# EAGLE design sqrwear-ledmatrix (EAGLE 6.5.0)
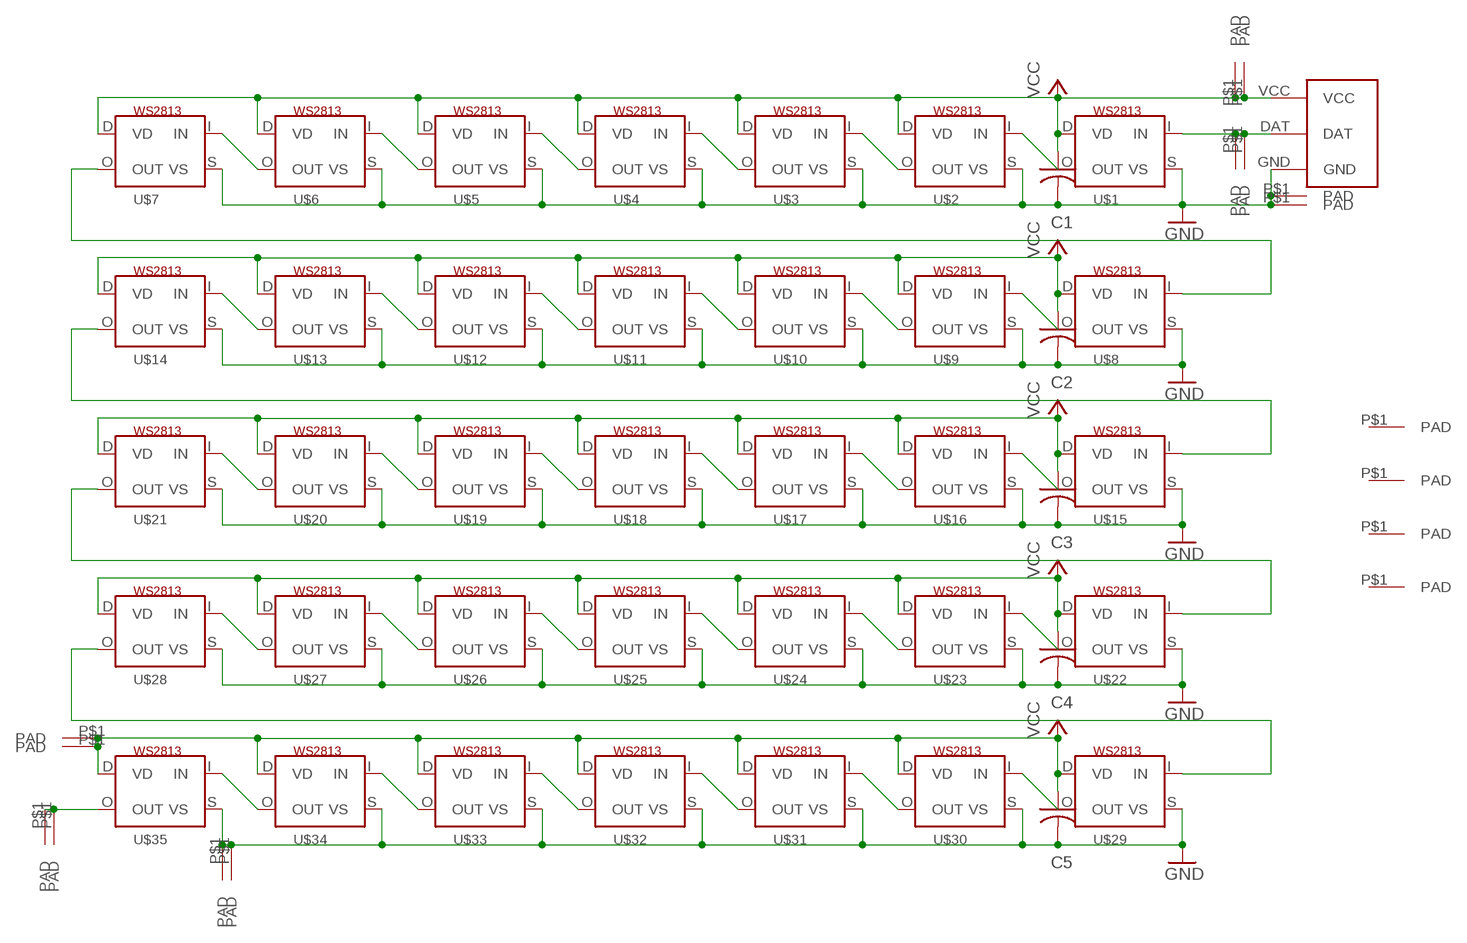
[diagram p0: schematic, sheet 1]

## Parts
C1  C-USC0805K  [C0805K]
C2  C-USC0805K  [C0805K]
C3  C-USC0805K  [C0805K]
C4  C-USC0805K  [C0805K]
C5  C-USC0805K  [C0805K]
U$1  WS2813  [RGBLED5050_4]
U$2  WS2813  [RGBLED5050_4]
U$3  WS2813  [RGBLED5050_4]
U$4  WS2813  [RGBLED5050_4]
U$5  WS2813  [RGBLED5050_4]
U$6  WS2813  [RGBLED5050_4]
U$7  WS2813  [RGBLED5050_4]
U$8  WS2813  [RGBLED5050_4]
U$9  WS2813  [RGBLED5050_4]
U$10  WS2813  [RGBLED5050_4]
U$11  WS2813  [RGBLED5050_4]
U$12  WS2813  [RGBLED5050_4]
U$13  WS2813  [RGBLED5050_4]
U$14  WS2813  [RGBLED5050_4]
U$15  WS2813  [RGBLED5050_4]
U$16  WS2813  [RGBLED5050_4]
U$17  WS2813  [RGBLED5050_4]
U$18  WS2813  [RGBLED5050_4]
U$19  WS2813  [RGBLED5050_4]
U$20  WS2813  [RGBLED5050_4]
U$21  WS2813  [RGBLED5050_4]
U$22  WS2813  [RGBLED5050_4]
U$23  WS2813  [RGBLED5050_4]
U$24  WS2813  [RGBLED5050_4]
U$25  WS2813  [RGBLED5050_4]
U$26  WS2813  [RGBLED5050_4]
U$27  WS2813  [RGBLED5050_4]
U$28  WS2813  [RGBLED5050_4]
U$29  WS2813  [RGBLED5050_4]
U$30  WS2813  [RGBLED5050_4]
U$31  WS2813  [RGBLED5050_4]
U$32  WS2813  [RGBLED5050_4]
U$33  WS2813  [RGBLED5050_4]
U$34  WS2813  [RGBLED5050_4]
U$35  WS2813  [RGBLED5050_4]
U$36  SQWMINI-MATRIX  [SQWMINI-MATRIX]
U$37  TESTPAD  [TESTPAD]
U$38  TESTPAD  [TESTPAD]
U$39  TESTPAD  [TESTPAD]
U$40  TESTPAD  [TESTPAD]
U$41  TESTPAD  [TESTPAD]
U$42  TESTPAD  [TESTPAD]
U$43  TESTPAD  [TESTPAD]
U$44  TESTPAD  [TESTPAD]
U$45  TESTPAD  [TESTPAD]
U$46  TESTPAD  [TESTPAD]
U$47  TESTPAD  [TESTPAD]
U$48  TESTPAD  [TESTPAD]
U$49  TESTPAD  [TESTPAD]
U$50  TESTPAD  [TESTPAD]
U$51  TESTPAD  [TESTPAD]
U$52  TESTPAD  [TESTPAD]

## Nets
DATIN: U$1.I(IN) U$36.DAT U$41.P$1(PAD) U$42.P$1(PAD)
DATOUT: U$35.O(OUT) U$47.P$1(PAD) U$48.P$1(PAD)
GND: C1.2 C2.2 C3.2 C4.2 C5.2 U$1.S(VS) U$2.S(VS) U$3.S(VS) U$4.S(VS) U$5.S(VS) U$6.S(VS) U$7.S(VS) U$8.S(VS) U$9.S(VS) U$10.S(VS) U$11.S(VS) U$12.S(VS) U$13.S(VS) U$14.S(VS) U$15.S(VS) U$16.S(VS) U$17.S(VS) U$18.S(VS) U$19.S(VS) U$20.S(VS) U$21.S(VS) U$22.S(VS) U$23.S(VS) U$24.S(VS) U$25.S(VS) U$26.S(VS) U$27.S(VS) U$28.S(VS) U$29.S(VS) U$30.S(VS) U$31.S(VS) U$32.S(VS) U$33.S(VS) U$34.S(VS) U$35.S(VS) U$36.GND U$39.P$1(PAD) U$40.P$1(PAD) U$45.P$1(PAD) U$46.P$1(PAD)
N$1: U$2.O(OUT) U$3.I(IN)
N$2: U$1.O(OUT) U$2.I(IN)
N$3: U$4.O(OUT) U$5.I(IN)
N$4: U$22.O(OUT) U$23.I(IN)
N$5: U$6.O(OUT) U$7.I(IN)
N$6: U$3.O(OUT) U$4.I(IN)
N$7: U$8.O(OUT) U$9.I(IN)
N$8: U$7.O(OUT) U$8.I(IN)
N$9: U$5.O(OUT) U$6.I(IN)
N$10: U$9.O(OUT) U$10.I(IN)
N$11: U$10.O(OUT) U$11.I(IN)
N$12: U$11.O(OUT) U$12.I(IN)
N$13: U$13.O(OUT) U$14.I(IN)
N$14: U$12.O(OUT) U$13.I(IN)
N$15: U$15.O(OUT) U$16.I(IN)
N$16: U$14.O(OUT) U$15.I(IN)
N$17: U$16.O(OUT) U$17.I(IN)
N$18: U$17.O(OUT) U$18.I(IN)
N$19: U$18.O(OUT) U$19.I(IN)
N$20: U$20.O(OUT) U$21.I(IN)
N$21: U$19.O(OUT) U$20.I(IN)
N$22: U$23.O(OUT) U$24.I(IN)
N$24: U$24.O(OUT) U$25.I(IN)
N$25: U$25.O(OUT) U$26.I(IN)
N$26: U$27.O(OUT) U$28.I(IN)
N$27: U$26.O(OUT) U$27.I(IN)
N$28: U$21.O(OUT) U$22.I(IN)
N$29: U$29.O(OUT) U$30.I(IN)
N$30: U$30.O(OUT) U$31.I(IN)
N$31: U$31.O(OUT) U$32.I(IN)
N$32: U$32.O(OUT) U$33.I(IN)
N$33: U$34.O(OUT) U$35.I(IN)
N$34: U$33.O(OUT) U$34.I(IN)
N$35: U$28.O(OUT) U$29.I(IN)
VCC: C1.1 C2.1 C3.1 C4.1 C5.1 U$1.D(VD) U$2.D(VD) U$3.D(VD) U$4.D(VD) U$5.D(VD) U$6.D(VD) U$7.D(VD) U$8.D(VD) U$9.D(VD) U$10.D(VD) U$11.D(VD) U$12.D(VD) U$13.D(VD) U$14.D(VD) U$15.D(VD) U$16.D(VD) U$17.D(VD) U$18.D(VD) U$19.D(VD) U$20.D(VD) U$21.D(VD) U$22.D(VD) U$23.D(VD) U$24.D(VD) U$25.D(VD) U$26.D(VD) U$27.D(VD) U$28.D(VD) U$29.D(VD) U$30.D(VD) U$31.D(VD) U$32.D(VD) U$33.D(VD) U$34.D(VD) U$35.D(VD) U$36.VCC U$37.P$1(PAD) U$38.P$1(PAD) U$43.P$1(PAD) U$44.P$1(PAD)
Unconnected: U$49.P$1(PAD) U$50.P$1(PAD) U$51.P$1(PAD) U$52.P$1(PAD)

## Library data of the parts
C1-C5 = adafruit2013:C-US: CAPACITOR, American symbol
U$1-U$35 = adafruit:WS2813
U$36 = LilyPad-Wearables:SQWMINI-MATRIX
U$37-U$52 = LilyPad-Wearables:TESTPAD

## Net classes
0 default: width 0.203 mm, clearance 0.203 mm

## Board
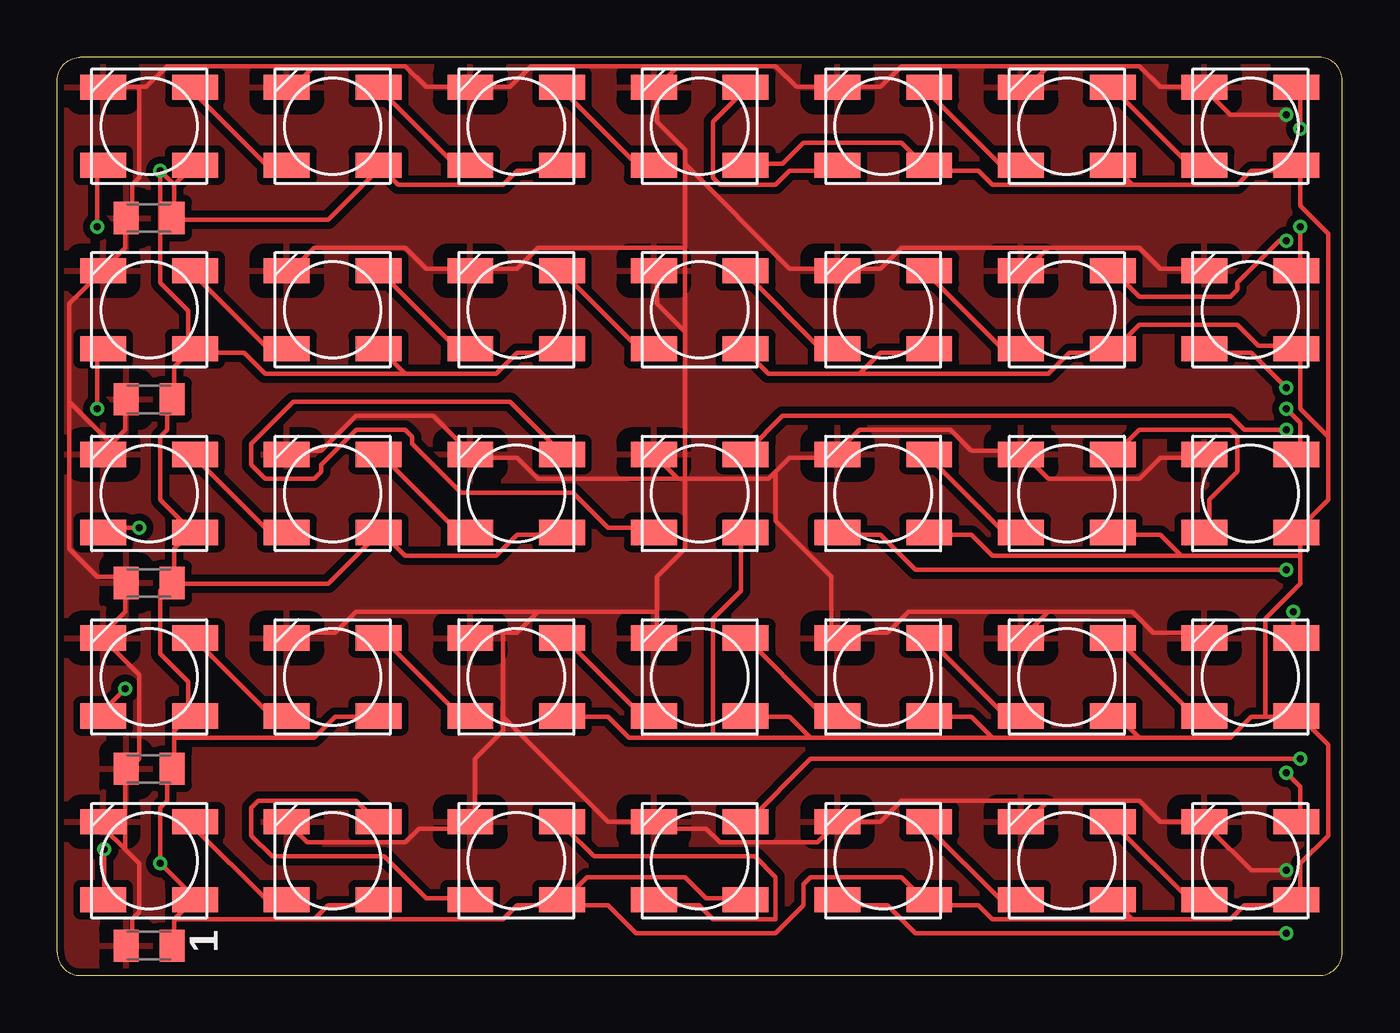
[diagram p1: board, top side]
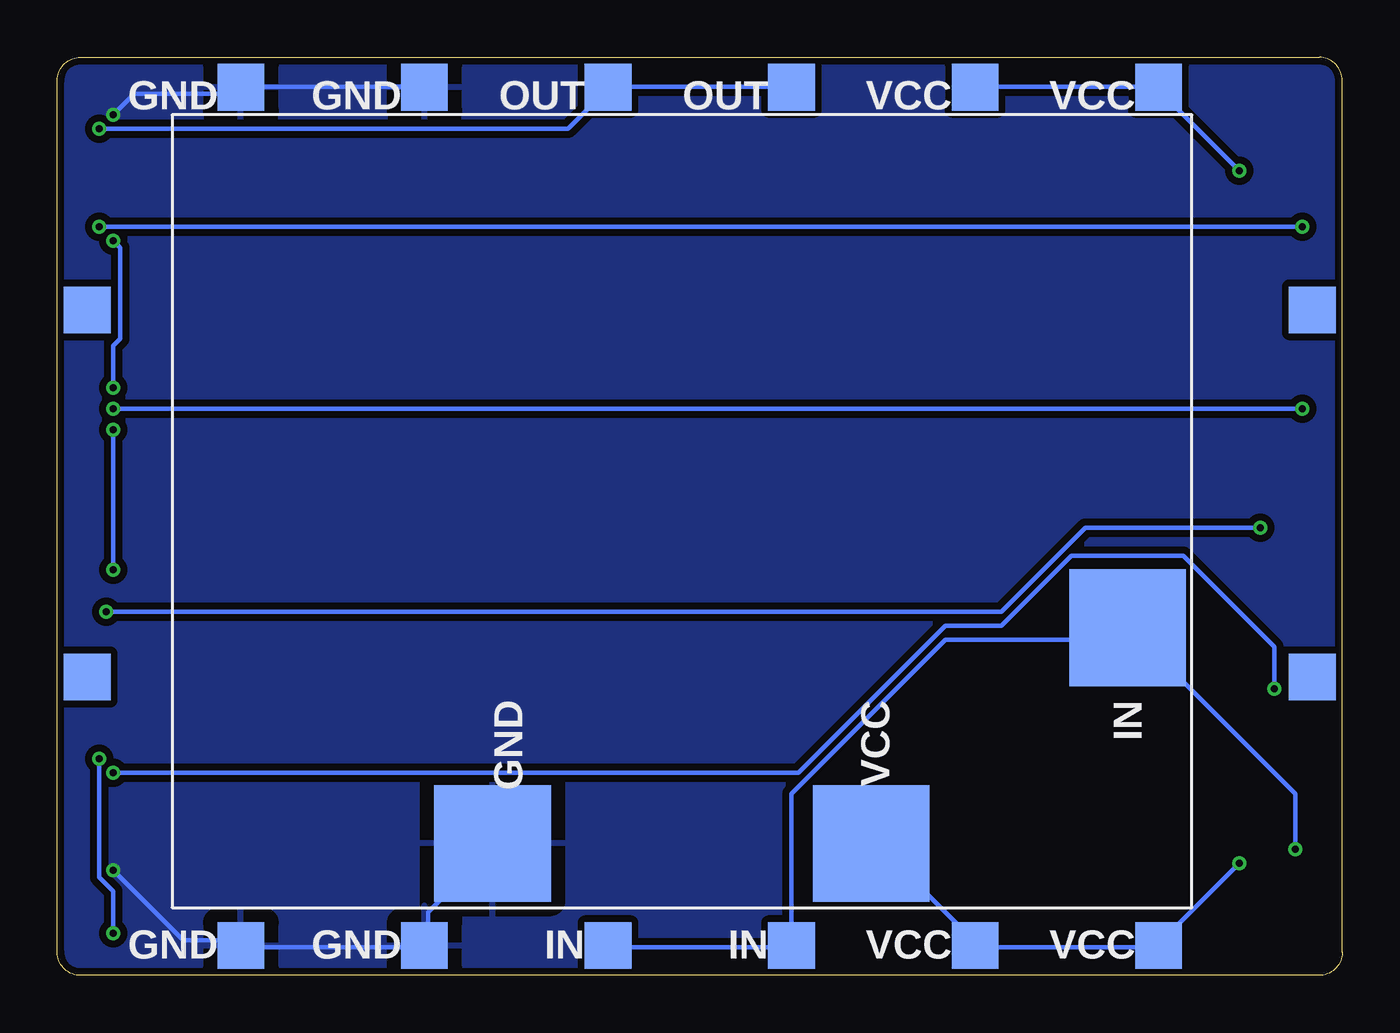
[diagram p2: board, bottom side, seen from below]

Size 56 x 40 mm. Coordinates in mm from the lower left corner, seen from the top.
Outline: 1,0 55,0 arc90 56,1 56,39 arc90 55,40 1,40 arc90 0,39 0,1 arc90 1,0
Copper layers (1*16): Top 0.035mm / dielectric 1.5mm / Bottom 0.035mm
Design rules "Fusion_eagle_rule_v1.1 *": minimum track width 6mil, minimum drill 12mil, track to track 6mil, track to pad 6mil, pad to pad 6mil, via to via 6mil, smd to smd 0mil, copper to edge 10mil, drill to drill 10mil, minimum pad ring 10mil, minimum via ring 6mil, stop-mask expansion 2mil, vias tented up to drill 100mil, thermal gap 25mil
vRestrict: area 0,3 to 40,51

### Footprints (pad centres in the part's own frame; a part is rotated, then mirrored left to right if it is on the bottom)
C0805K = smd 1.1 x 1.4: 1 -1,0; 2 1,0
RGBLED5050_4 = smd 2 x 1.1: D -2,1.7; I 2,1.7; O -2,-1.7; S 2,-1.7
SQWMINI-MATRIX = smd 5.08 x 5.08: DAT 22.352,41.656; GND 31.75,13.97; VCC 31.75,30.48
TESTPAD = smd 2.032 x 2.032: P$1 0,0

### Placement (x,y rotation side)
C1  4,1.3 180 top
C2  4,9 180 top
C3  4,17.1 180 top
C4  4,25.1 180 top
C5  4,33 180 top
U$1  4,5 180 top
U$2  12,5 180 top
U$3  20,5 180 top
U$4  28,5 180 top
U$5  36,5 180 top
U$6  44,5 180 top
U$7  52,5 180 top
U$8  4,13 180 top
U$9  12,13 180 top
U$10  20,13 180 top
U$11  28,13 180 top
U$12  36,13 180 top
U$13  44,13 180 top
U$14  52,13 180 top
U$15  4,21 180 top
U$16  12,21 180 top
U$17  20,21 180 top
U$18  28,21 180 top
U$19  36,21 180 top
U$20  44,21 180 top
U$21  52,21 180 top
U$22  4,29 180 top
U$23  12,29 180 top
U$24  20,29 180 top
U$25  28,29 180 top
U$26  36,29 180 top
U$27  44,29 180 top
U$28  52,29 180 top
U$29  4,37 180 top
U$30  12,37 180 top
U$31  20,37 180 top
U$32  28,37 180 top
U$33  36,37 180 top
U$34  44,37 180 top
U$35  52,37 180 top
U$36  51,37.5 270 bottom
U$37  8,1.3 270 bottom
U$38  16,1.3 270 bottom
U$39  40,1.3 270 bottom
U$40  48,1.3 270 bottom
U$41  24,1.3 270 bottom
U$42  32,1.3 270 bottom
U$43  8,38.7 270 bottom
U$44  16,38.7 270 bottom
U$45  40,38.7 270 bottom
U$46  48,38.7 270 bottom
U$47  24,38.7 270 bottom
U$48  32,38.7 270 bottom
U$49  54.7,13 270 bottom
U$50  54.7,29 270 bottom
U$51  1.3,13 270 bottom
U$52  1.3,29 270 bottom

### Tracks (layer width: path | path; a pad name or v marks a point on that pad's centre or on a via)
DATIN  (via drill 0.3)
  Top 0.203: v2.05,5.49 2.05,3.35 U$1.I
  Bottom 0.203: U$42.P$1 31.92,1.22 24.3,1.22 U$41.P$1 24,1.52 24,7.92 17.29,14.63 8.76,14.63 | v2.05,5.49 2.05,7.92 8.76,14.63 | 8.76,14.63 9.06,14.94 U$36.DAT 8.76,14.63
DATOUT  (via drill 0.3)
  Top 0.203: v54.17,36.88 54.17,38.41 U$35.O
  Bottom 0.203: v54.17,36.88 33.75,36.88 32.23,38.41 U$48.P$1 31.92,38.71 24.3,38.71 U$47.P$1
GND  (via drill 0.3)
  Top 0.203: 2.96,5.49 2.05,6.4 U$1.S | 2.96,5.49 3.57,4.88 3.57,2.74 3.27,2.44 3.27,1.52 C1.2 | 2.96,5.49 2.96,8.84 C2.2 3.27,9.14 3.57,9.45 3.57,13.11 2.05,14.63 U$8.S 2.05,14.94 2.96,15.85 2.96,17.07 C3.2 2.96,17.37 1.75,17.37 0.53,18.59 0.53,24.99 | 2.35,23.16 2.05,22.86 U$15.S 2.35,23.16 | 2.35,23.16 2.96,23.77 2.96,24.99 C4.2 | 11.19,39.62 15.16,39.62 16.07,38.71 17.9,38.71 U$31.S 18.2,38.71 19.73,38.71 20.64,39.62 27.04,39.62 | 11.19,39.62 10.28,38.71 U$30.S | 3.57,38.71 3.88,38.71 4.79,39.62 11.19,39.62 | 3.57,38.71 2.05,38.71 U$29.S | 3.57,38.71 3.57,34.75 3.27,34.44 3.27,33.22 C5.2 2.96,32.92 2.96,31.7 2.05,30.79 U$22.S 1.75,30.48 0.53,29.26 0.53,24.99 | 0.53,24.99 2.35,23.16 | 43.2,7.62 47.16,7.62 48.08,6.71 49.9,6.71 U$7.S 50.21,6.4 52.04,4.57 v53.56,4.57 | 43.2,7.62 42.28,6.71 U$6.S | 43.2,7.62 36.8,7.62 35.88,6.71 34.05,6.71 U$5.S 33.75,6.4 33.14,5.79 28.87,5.79 28.26,6.4 26.13,6.4 U$4.S 25.82,6.71 24,6.71 19.42,11.28 | 43.2,39.62 47.16,39.62 48.08,38.71 49.9,38.71 U$35.S 50.21,38.41 51.12,37.49 v53.56,37.49 | 43.2,39.62 42.28,38.71 U$34.S | 43.2,39.62 36.8,39.62 35.88,38.71 34.05,38.71 U$33.S 33.75,38.71 32.23,38.71 31.31,39.62 27.04,39.62 | 43.2,31.7 47.16,31.7 48.08,30.79 49.9,30.79 U$28.S | 43.2,31.7 42.28,30.79 U$27.S | 43.2,31.7 36.8,31.7 35.88,30.79 34.05,30.79 U$26.S 33.75,30.79 31.92,30.79 27.35,35.36 | 43.2,15.85 46.86,15.85 47.77,14.94 49.9,14.94 U$14.S | 43.2,15.85 42.28,14.94 U$13.S | 43.2,15.85 37.1,15.85 36.19,14.94 34.05,14.94 U$12.S 33.75,14.94 33.75,17.37 31.31,19.81 31.31,21.95 | U$23.S 10.28,30.79 11.19,31.7 15.16,31.7 16.07,30.79 17.9,30.79 U$24.S 18.2,30.79 20.03,30.79 20.95,31.7 27.35,31.7
  Top 0.203: U$21.S 49.9,22.55 48.08,22.55 47.16,21.64 43.2,21.64 42.28,22.55 U$20.S 41.98,22.86 39.85,22.86 38.93,23.77 34.97,23.77 34.05,22.86 U$19.S 33.75,22.55 31.92,22.55 31.31,21.95 | U$2.S 10.28,6.4 10.89,5.79 15.16,5.79 15.77,6.4 17.9,6.4 U$3.S 18.2,6.71 18.2,9.45 19.42,10.67 19.42,11.28 | 31.31,21.95 31.01,21.64 27.35,21.64 | 27.04,21.64 27.35,21.64 | 27.04,21.64 26.13,22.55 U$18.S | 26.13,15.85 26.13,17.37 27.35,18.59 27.35,21.64 | 26.13,15.85 26.13,14.94 U$11.S | 27.35,28.04 26.13,29.26 26.13,30.48 U$25.S | 27.35,21.64 27.35,28.04 | 19.42,14.94 20.03,14.94 20.95,15.85 | 19.42,14.94 18.2,14.94 U$10.S | 26.13,15.85 20.95,15.85 | 27.04,21.64 20.95,21.64 20.03,22.55 18.2,22.55 U$17.S 17.9,22.86 16.38,24.38 13.02,24.38 11.5,22.86 10.28,22.86 U$16.S | 20.95,15.85 13.02,15.85 12.11,14.94 10.28,14.94 U$9.S | 27.35,28.04 27.35,31.7 | 27.35,31.7 27.35,35.36 | 27.35,35.36 27.35,35.97 26.13,37.19 26.13,38.41 U$32.S 26.13,38.71 27.04,39.62 | 19.42,14.94 19.42,11.28
  Bottom 0.203: U$36.GND 37.1,5.49 39.85,2.74 39.85,1.52 U$39.P$1 40.15,1.22 47.77,1.22 U$40.P$1 48.08,1.52 50.51,1.52 v53.56,4.57 | U$45.P$1 40.15,38.71 47.77,38.71 U$46.P$1 48.08,38.41 52.65,38.41 v53.56,37.49
  pour Top (isolate 0.305): -4,0 -4,40 56,40 56,0
  pour Bottom (isolate 0.305): -4,0 -4,40 56,40 56,0
N$1
  Top 0.203: U$3.I 17.9,3.35 16.07,3.35 14.24,5.18 9.37,5.18 8.45,6.1 8.45,7.32 8.76,7.62 13.02,7.62 13.94,6.71 U$2.O
N$2
  Top 0.203: U$2.I 9.97,3.35 9.06,3.35 6.01,6.4 U$1.O
N$3  (via drill 0.3)
  Top 0.203: v53.56,1.83 37.41,1.83 36.19,3.05 34.05,3.05 U$5.I | v54.17,9.45 32.84,9.45 30.09,6.71 U$4.O
  Bottom 0.203: v53.56,1.83 53.56,3.66 54.17,4.27 v54.17,9.45
N$4
  Top 0.203: U$23.I 9.97,27.43 9.06,27.43 6.01,30.48 U$22.O
N$5
  Top 0.203: U$7.I 49.9,3.35 49.29,3.35 46.25,6.4 U$6.O
N$6
  Top 0.203: U$4.I 26.13,3.05 27.96,3.05 28.57,2.44 31.31,2.44 31.31,4.27 30.4,5.18 23.39,5.18 22.17,6.4 U$3.O
N$7
  Top 0.203: U$9.I 9.97,11.58 9.06,11.58 6.01,14.63 U$8.O
N$8  (via drill 0.3)
  Top 0.203: v53.56,8.84 54.17,8.23 54.17,6.71 U$7.O | v2.96,12.5 2.05,11.58 U$8.I
  Bottom 0.203: v53.56,8.84 23.69,8.84 17.29,15.24 14.85,15.24 11.8,18.29 6.93,18.29 2.96,14.33 v2.96,12.5
N$9
  Top 0.203: U$6.I 41.98,3.35 41.06,3.35 38.02,6.4 U$5.O
N$10
  Top 0.203: U$10.I 17.9,11.58 17.29,11.58 14.24,14.63 U$9.O
N$11
  Top 0.203: U$11.I 25.82,11.58 25.21,11.58 22.17,14.63 U$10.O
N$12
  Top 0.203: U$12.I 33.75,11.58 33.14,11.58 30.09,14.63 U$11.O
N$13
  Top 0.203: U$14.I 49.9,11.58 49.29,11.58 46.25,14.63 U$13.O
N$14
  Top 0.203: U$13.I 41.98,11.58 41.06,11.58 38.02,14.63 U$12.O
N$15
  Top 0.203: U$16.I 9.97,19.51 9.06,19.51 6.01,22.55 U$15.O
N$16  (via drill 0.3)
  Top 0.203: v53.87,15.85 53.87,14.94 U$14.O | v3.57,19.51 2.05,19.51 U$15.I
  Bottom 0.203: v53.87,15.85 14.85,15.85 11.19,19.51 v3.57,19.51
N$17
  Top 0.203: U$17.I 17.9,19.51 17.29,19.51 14.24,22.55 U$16.O
N$18
  Top 0.203: U$18.I 25.82,19.51 24,19.51 22.47,21.03 17.59,21.03 15.46,23.16 15.46,23.47 15.16,23.77 13.02,23.77 11.5,22.25 11.5,21.95 11.19,21.64 9.06,21.64 8.45,22.25 8.45,23.16 10.28,24.99 19.73,24.99 21.86,22.86 U$17.O
N$19  (via drill 0.3)
  Top 0.203: v53.56,17.68 37.41,17.68 35.88,19.2 34.05,19.2 U$19.I | v53.56,23.77 51.73,23.77 51.12,24.38 31.62,24.38 30.09,22.86 U$18.O
  Bottom 0.203: v53.56,23.77 v53.56,17.68
N$20
  Top 0.203: U$21.I 50.21,19.51 50.21,20.73 51.43,21.95 51.43,23.47 51.12,23.77 47.16,23.77 46.25,22.86 U$20.O
N$21
  Top 0.203: U$20.I 41.98,19.51 41.06,19.51 38.02,22.55 U$19.O
N$22
  Top 0.203: U$24.I 17.9,27.43 17.29,27.43 14.24,30.48 U$23.O
N$24
  Top 0.203: U$25.I 25.82,27.43 25.21,27.43 22.17,30.48 U$24.O
N$25
  Top 0.203: U$26.I 33.75,27.43 33.14,27.43 30.09,30.48 U$25.O
N$26  (via drill 0.3)
  Top 0.203: v53.56,25.6 52.04,27.13 50.21,27.13 U$28.I | v53.56,32 53.26,32 51.43,30.18 51.43,29.87 51.12,29.57 47.16,29.57 46.25,30.48 U$27.O
  Bottom 0.203: v53.56,25.6 53.56,27.43 53.26,27.74 53.26,31.7 v53.56,32
N$27
  Top 0.203: U$27.I 41.98,27.43 41.06,27.43 38.02,30.48 U$26.O
N$28  (via drill 0.3)
  Top 0.203: v53.56,24.69 54.17,24.08 54.17,22.86 U$21.O | v1.75,24.69 1.75,27.13 U$22.I
  Bottom 0.203: v1.75,24.69 v53.56,24.69
N$29
  Top 0.203: U$30.I 9.97,35.36 9.06,35.36 6.01,38.41 U$29.O
N$30
  Top 0.203: U$31.I 17.9,35.36 17.29,35.36 14.24,38.41 U$30.O
N$31
  Top 0.203: U$32.I 25.82,35.36 25.21,35.36 22.17,38.41 U$31.O
N$32
  Top 0.203: U$33.I 33.75,35.05 31.92,35.05 31.31,34.44 28.87,34.44 28.57,34.75 28.57,37.19 29.79,38.41 U$32.O
N$33
  Top 0.203: U$35.I 49.9,35.36 49.29,35.36 46.25,38.41 U$34.O
N$34
  Top 0.203: U$34.I 41.98,35.36 41.06,35.36 38.02,38.41 U$33.O
N$35  (via drill 0.3)
  Top 0.203: v54.17,32.61 54.17,30.79 U$28.O | v1.75,32.61 1.75,35.05 U$29.I
  Bottom 0.203: v1.75,32.61 v54.17,32.61
VCC  (via drill 0.3)
  Top 0.203: U$22.D 5.71,27.13 5.1,26.52 5.1,25.3 C4.1 4.79,24.99 4.79,23.77 4.49,23.47 4.49,20.73 5.71,19.51 U$15.D 5.71,19.2 5.1,18.59 5.1,17.37 C3.1 | 15.16,26.21 19.12,26.21 20.03,27.13 21.86,27.13 U$24.D | 15.16,26.21 14.24,27.13 U$23.D | 15.16,26.21 9.06,26.21 8.15,27.13 6.01,27.13 U$22.D | 5.1,34.44 5.1,33.22 C5.1 5.1,32.92 11.8,32.92 13.94,35.05 U$30.D 14.24,35.05 14.85,34.44 19.42,34.44 20.03,35.05 21.86,35.05 U$31.D | 5.1,34.44 5.71,35.05 U$29.D | 5.1,34.44 v4.49,35.05 4.49,30.18 5.71,28.96 5.71,27.43 U$22.D | 5.1,10.36 5.1,10.67 5.71,11.28 U$8.D 5.71,11.58 5.71,12.8 4.49,14.02 4.49,16.76 4.79,17.07 C3.1 | 5.1,10.36 5.1,9.14 C2.1 4.79,8.84 4.79,7.62 4.49,7.32 v4.49,4.88 6.01,3.35 U$1.D 5.71,3.05 5.1,2.44 | 5.1,10.36 11.19,10.36 12.11,11.28 13.94,11.28 U$9.D | U$17.D 21.86,19.2 20.03,19.2 19.12,18.29 15.16,18.29 14.24,19.2 U$16.D 13.94,19.2 11.8,17.07 5.1,17.07 C3.1 | U$4.D 29.79,3.35 28.26,3.35 27.35,4.27 23.08,4.27 22.17,3.35 U$3.D | 5.1,2.44 5.1,1.52 C1.1 | 11.19,2.44 11.8,3.05 13.94,3.05 U$2.D | 5.1,2.44 11.19,2.44 | 11.19,2.44 19.42,2.44 20.03,3.05 21.86,3.05 U$3.D | 46.86,34.44 51.43,34.44 52.04,35.05 53.87,35.05 U$35.D 54.17,35.05 54.17,33.53 55.39,32.31 55.39,23.47 | 46.86,34.44 46.25,35.05 U$34.D | 46.86,34.44 40.76,34.44 40.15,35.05 38.02,35.05 U$33.D 37.71,35.36 36.8,36.27 32.53,36.27 31.62,35.36 30.09,35.36 U$32.D | 34.97,26.21 35.88,27.13 37.71,27.13 U$26.D | 34.97,26.21 31.01,26.21 30.09,27.13 U$25.D | 34.97,26.21 43.2,26.21 44.11,27.13 45.94,27.13 U$27.D 46.25,27.43 47.16,28.35 51.43,28.35 52.34,27.43 53.87,27.43 U$28.D 54.17,27.13 54.17,24.69 55.39,23.47
  Top 0.203: 46.86,2.44 51.12,2.44 51.73,3.05 53.87,3.05 U$7.D 54.17,3.35 54.17,4.88 55.39,6.1 55.39,10.06 54.17,11.28 U$14.D 53.87,11.28 52.65,11.28 | 46.86,2.44 46.25,3.05 U$6.D | 46.86,2.44 40.76,2.44 40.15,3.05 38.02,3.05 U$5.D 37.71,3.35 36.8,4.27 32.84,4.27 32.53,3.96 32.53,3.05 31.31,1.83 25.21,1.83 24,3.05 22.17,3.05 U$3.D | 52.65,11.28 52.04,11.28 51.12,10.36 47.16,10.36 | 47.16,10.36 46.25,11.28 U$13.D | 40.76,10.36 39.85,11.28 38.02,11.28 U$12.D | 47.16,10.36 40.76,10.36 | 32.84,10.36 31.92,11.28 30.09,11.28 U$11.D | 40.76,10.36 32.84,10.36 | 32.84,10.36 28.57,10.36 | 28.57,10.36 24.91,10.36 24,11.28 22.17,11.28 U$10.D | 54.17,18.29 54.17,17.07 52.65,15.54 52.65,11.28 | 54.17,18.29 54.17,19.2 U$21.D 54.17,19.51 55.39,20.73 55.39,23.47 | 48.99,18.29 48.08,19.2 46.25,19.2 U$20.D | 54.17,18.29 48.99,18.29 | 48.99,18.29 40.76,18.29 39.85,19.2 38.02,19.2 U$19.D | 28.57,10.36 28.57,15.54 29.79,16.76 29.79,19.2 U$18.D
  Bottom 0.203: U$44.P$1 15.77,38.71 8.15,38.71 U$43.P$1 7.84,38.41 v4.49,35.05 | U$36.VCC 20.34,5.79 16.07,1.52 U$38.P$1 15.77,1.22 8.15,1.22 U$37.P$1 7.84,1.52 v4.49,4.88

### Text on the board
tNames: 1
bNames: VCC | VCC | OUT | OUT | GND | GND | IN | VCC | GND | VCC | VCC | IN | IN | GND | GND